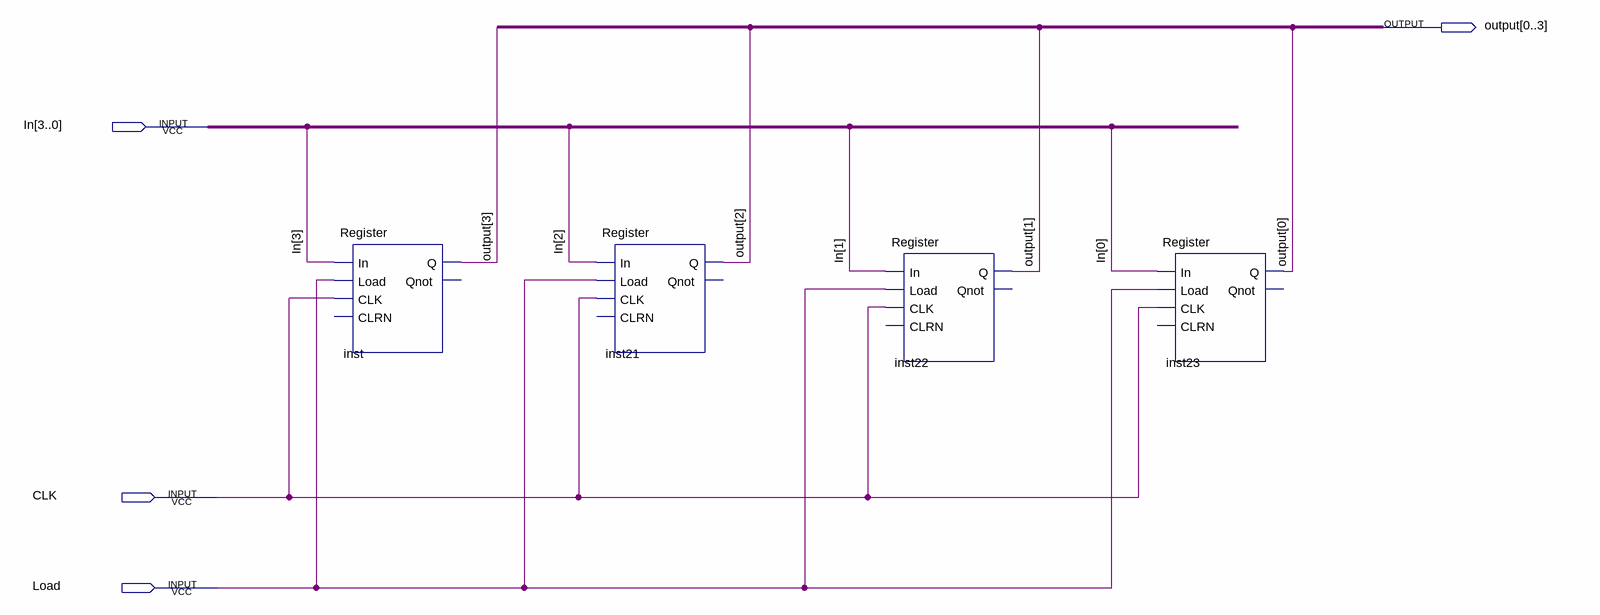
[diagram p0: schematic sheet]
// Quartus schematic RegisterRow.bdf as structural Verilog: 4 symbols, 4 pins
module RegisterRow (
  input  [3:0] In,
  input  CLK,
  input  Load,
  output [0:3] \output 
);

  Register inst (.In(In[3]), .Load(Load), .CLK(CLK), .Q(\output [3]));  // open: CLRN, Qnot
  Register inst21 (.In(In[2]), .Load(Load), .CLK(CLK), .Q(\output [2]));  // open: CLRN, Qnot
  Register inst22 (.In(In[1]), .Load(Load), .CLK(CLK), .Q(\output [1]));  // open: CLRN, Qnot
  Register inst23 (.In(In[0]), .Load(Load), .CLK(CLK), .Q(\output [0]));  // open: CLRN, Qnot
endmodule
